# EAGLE schematic LAUNCHXL-TMS57004_RevB (EAGLE 6.1)

## Sheet 1 of 6: Block Diagram
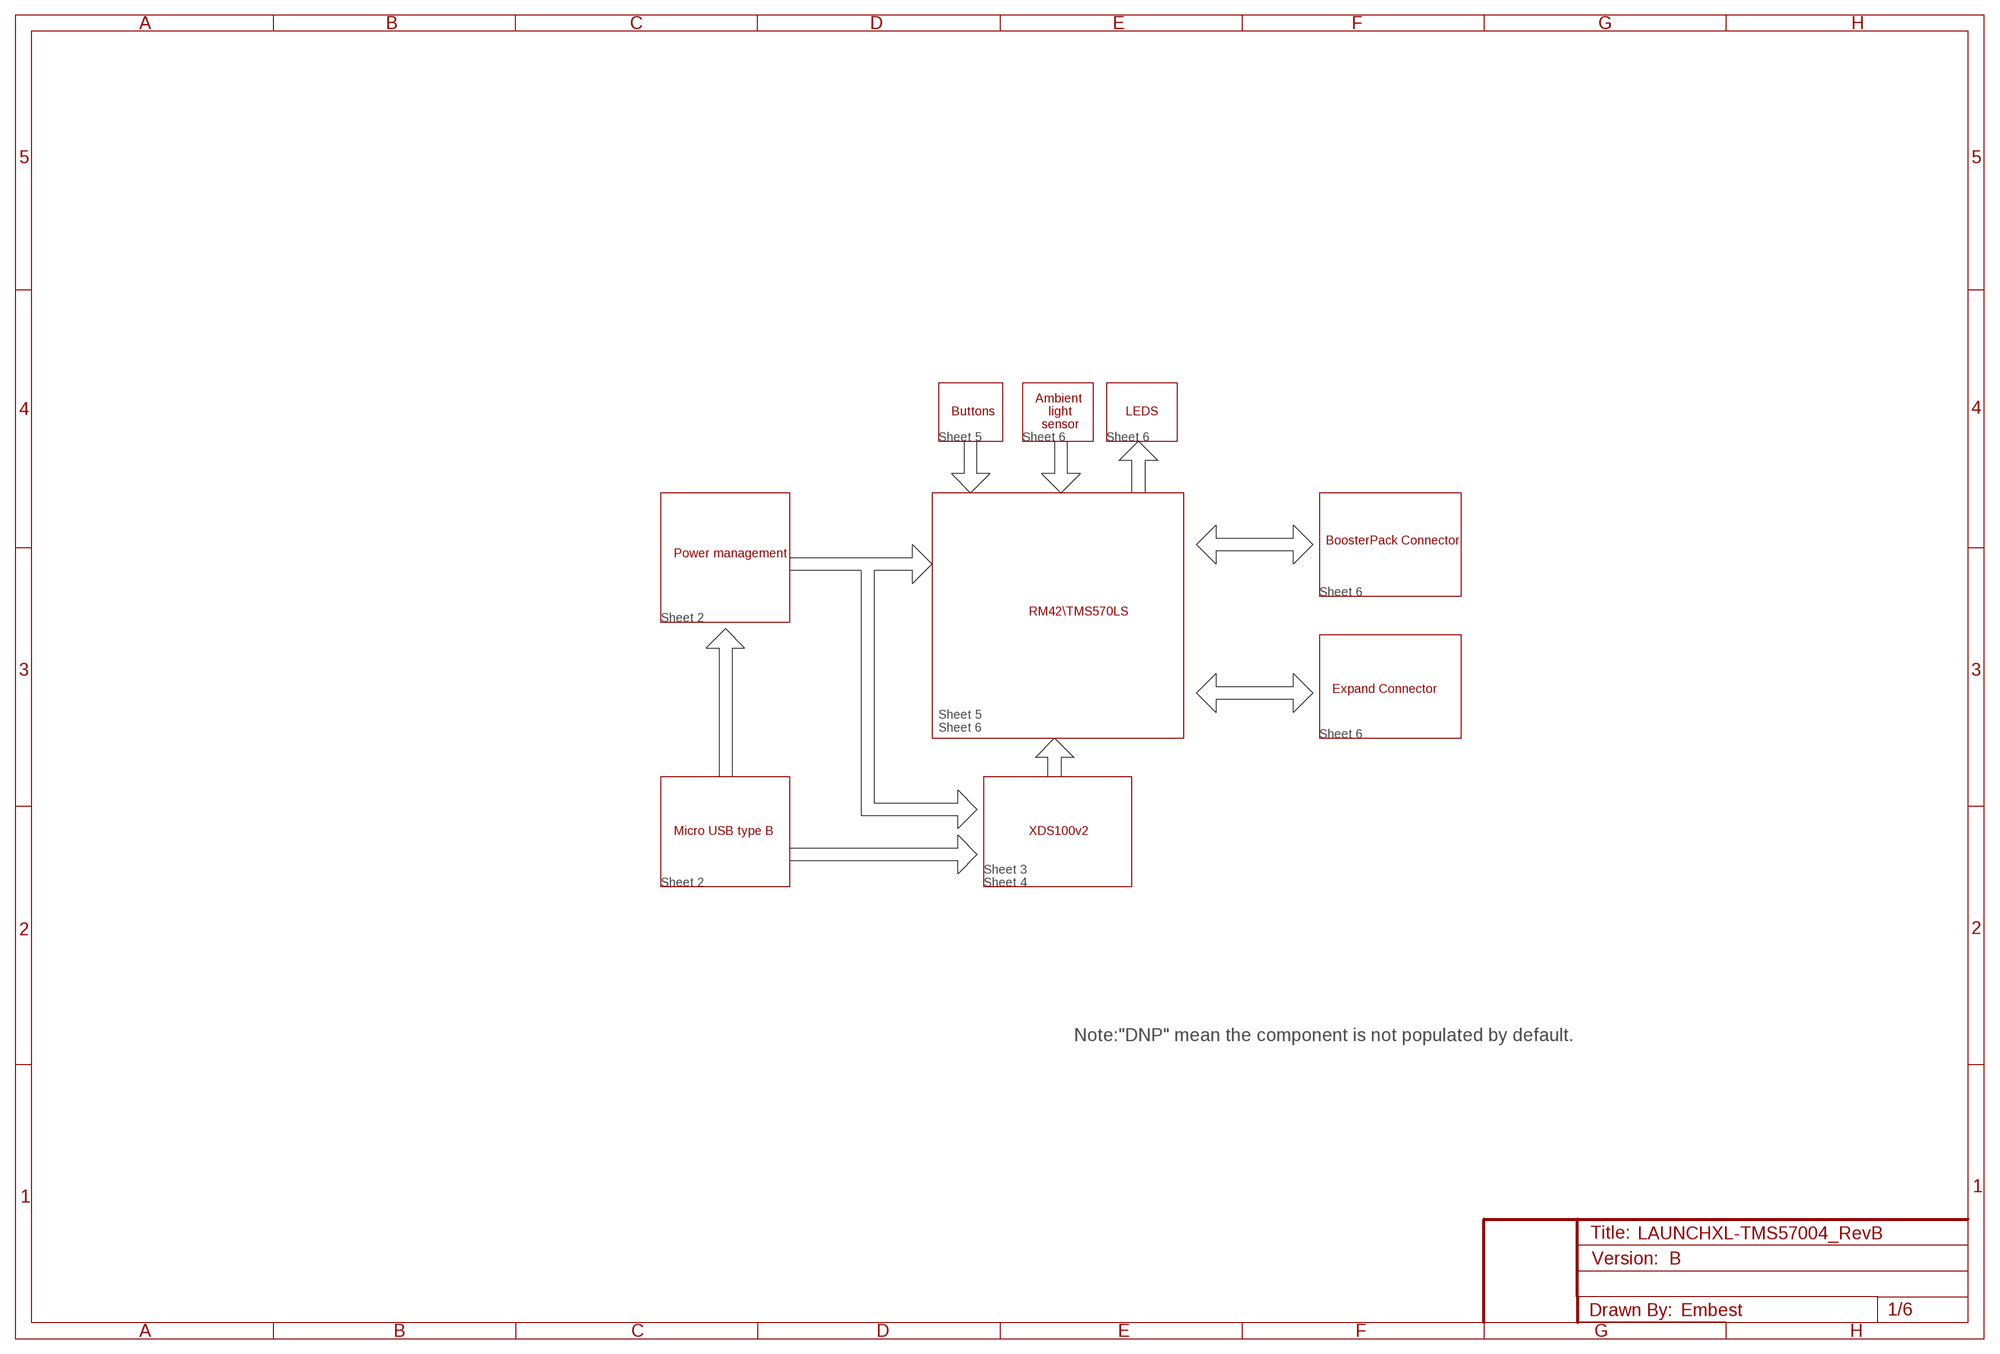
[diagram p0: schematic, sheet 1]

### Notes on the sheet
- Ambient
- Buttons | light | LEDS
- sensor
- Sheet 5 | Sheet 6 | Sheet 6
- BoosterPack Connector
- Power management
- Sheet 6
- RM42\\TMS570LS
- Sheet 2
- Expand Connector
- Sheet 5
- Sheet 6
- Sheet 6
- Micro USB type B | XDS100v2
- Sheet 3
- Sheet 2 | Sheet 4
- Note:"DNP" mean the component is not populated by default.
- B
- Embest

## Sheet 2 of 6: Power supply
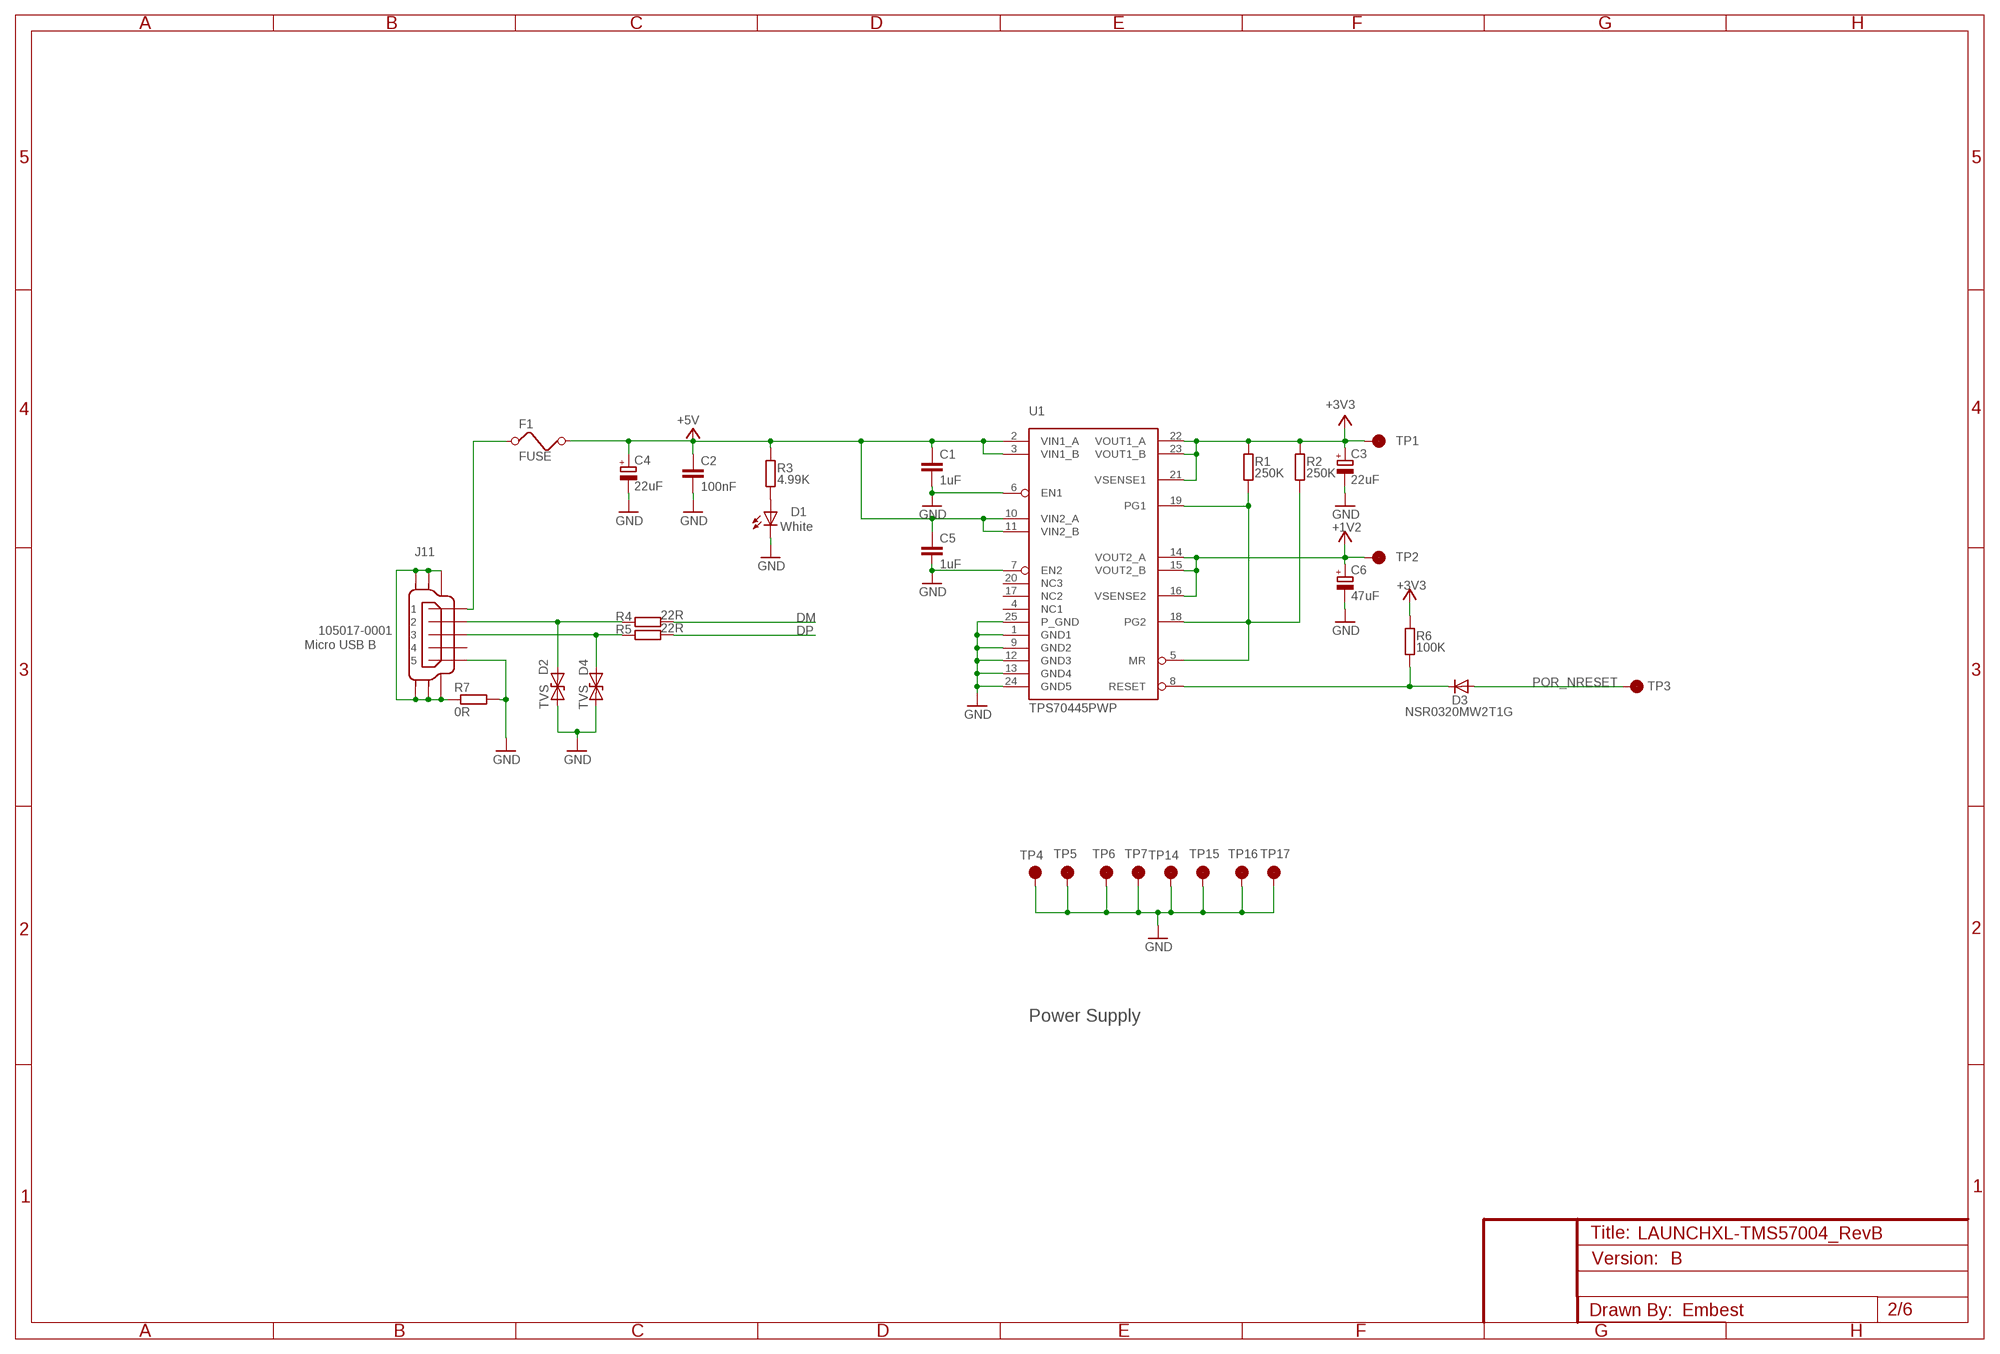
[diagram p1: schematic, sheet 2]

### Parts
C1  1uF  CAP0603  [0603]
C2  100nF  CAP0402  [0402]
C3  22uF  CAP-TAN  [CT3528]
C4  22uF  CAP-TAN  [CT3528]
C5  1uF  CAP0603  [0603]
C6  47uF  CAP-TAN  [CT3528]
D1  White  CHIP-LED  [LED0805]
D2  TVS  [0402]
D3  NSR0320MW2T1G  [SOD-323]
D4  TVS  [0402]
F1  FUSE  [0805]
J11  105017-0001  [MICRO_USB]
R1  250K  RES0402  [0402]
R2  250K  RES0402  [0402]
R3  4.99K  RES0402  [0402]
R4  22R  RES0402  [0402]
R5  22R  RES0402  [0402]
R6  100K  RES0402  [0402]
R7  0R  RES0603  [0603]
TP1  TP  [TP]
TP2  TP  [TP]
TP3  TP  [TP]
TP4  TP  [TP]
TP5  TP  [TP]
TP6  TP  [TP]
TP7  TP  [TP]
TP14  TP  [TP]
TP15  TP  [TP]
TP16  TP  [TP]
TP17  TP  [TP]
U1  TPS70445PWP  [TSSOP24]

### Nets
1A: F1.1 J11.1
+3V3: C3.+ R1.2 R2.2 R6.2 TP1.1 U1.21(VSENSE1) U1.22(VOUT1_A) U1.23(VOUT1_B) ; also sheet 3,4,5,6
+5V: C1.1 C2.1 C4.+ C5.1 F1.2 R3.2 U1.2(VIN1_A) U1.3(VIN1_B) U1.10(VIN2_A) U1.11(VIN2_B) ; also sheet 6
DM: R4.1 ; also sheet 3
DP: R5.1 ; also sheet 3
GND: C1.2 C2.2 C3.- C4.- C5.2 C6.- D1.C D2.1 D4.2 J11.5 R7.2 TP4.1 TP5.1 TP6.1 TP7.1 TP14.1 TP15.1 TP16.1 TP17.1 U1.1(GND1) U1.6(EN1) U1.7(EN2) U1.9(GND2) U1.12(GND3) U1.13(GND4) U1.24(GND5) U1.25(P_GND) ; also sheet 3,4,5,6
N$1: J11.6 J11.7 J11.8 J11.9 J11.10 J11.11 R7.1
N$4: D2.2 J11.2 R4.2
N$5: D4.1 J11.3 R5.2
N$6: D3.C R6.1 U1.8(RESET)
N$7: R1.1 R2.1 U1.5(MR) U1.18(PG2) U1.19(PG1)
N$8: D1.A R3.1
POR_NRESET: D3.A TP3.1 ; also sheet 5,6
VCC: C6.+ TP2.1 U1.14(VOUT2_A) U1.15(VOUT2_B) U1.16(VSENSE2) ; supply symbol labelled +1V2 ; also sheet 5
Unconnected: J11.4 U1.4(NC1) U1.17(NC2) U1.20(NC3)

### Notes on the sheet
- Micro USB B
- Power Supply
- B
- Embest

## Sheet 3 of 6: XDS100V2 FT2232HL
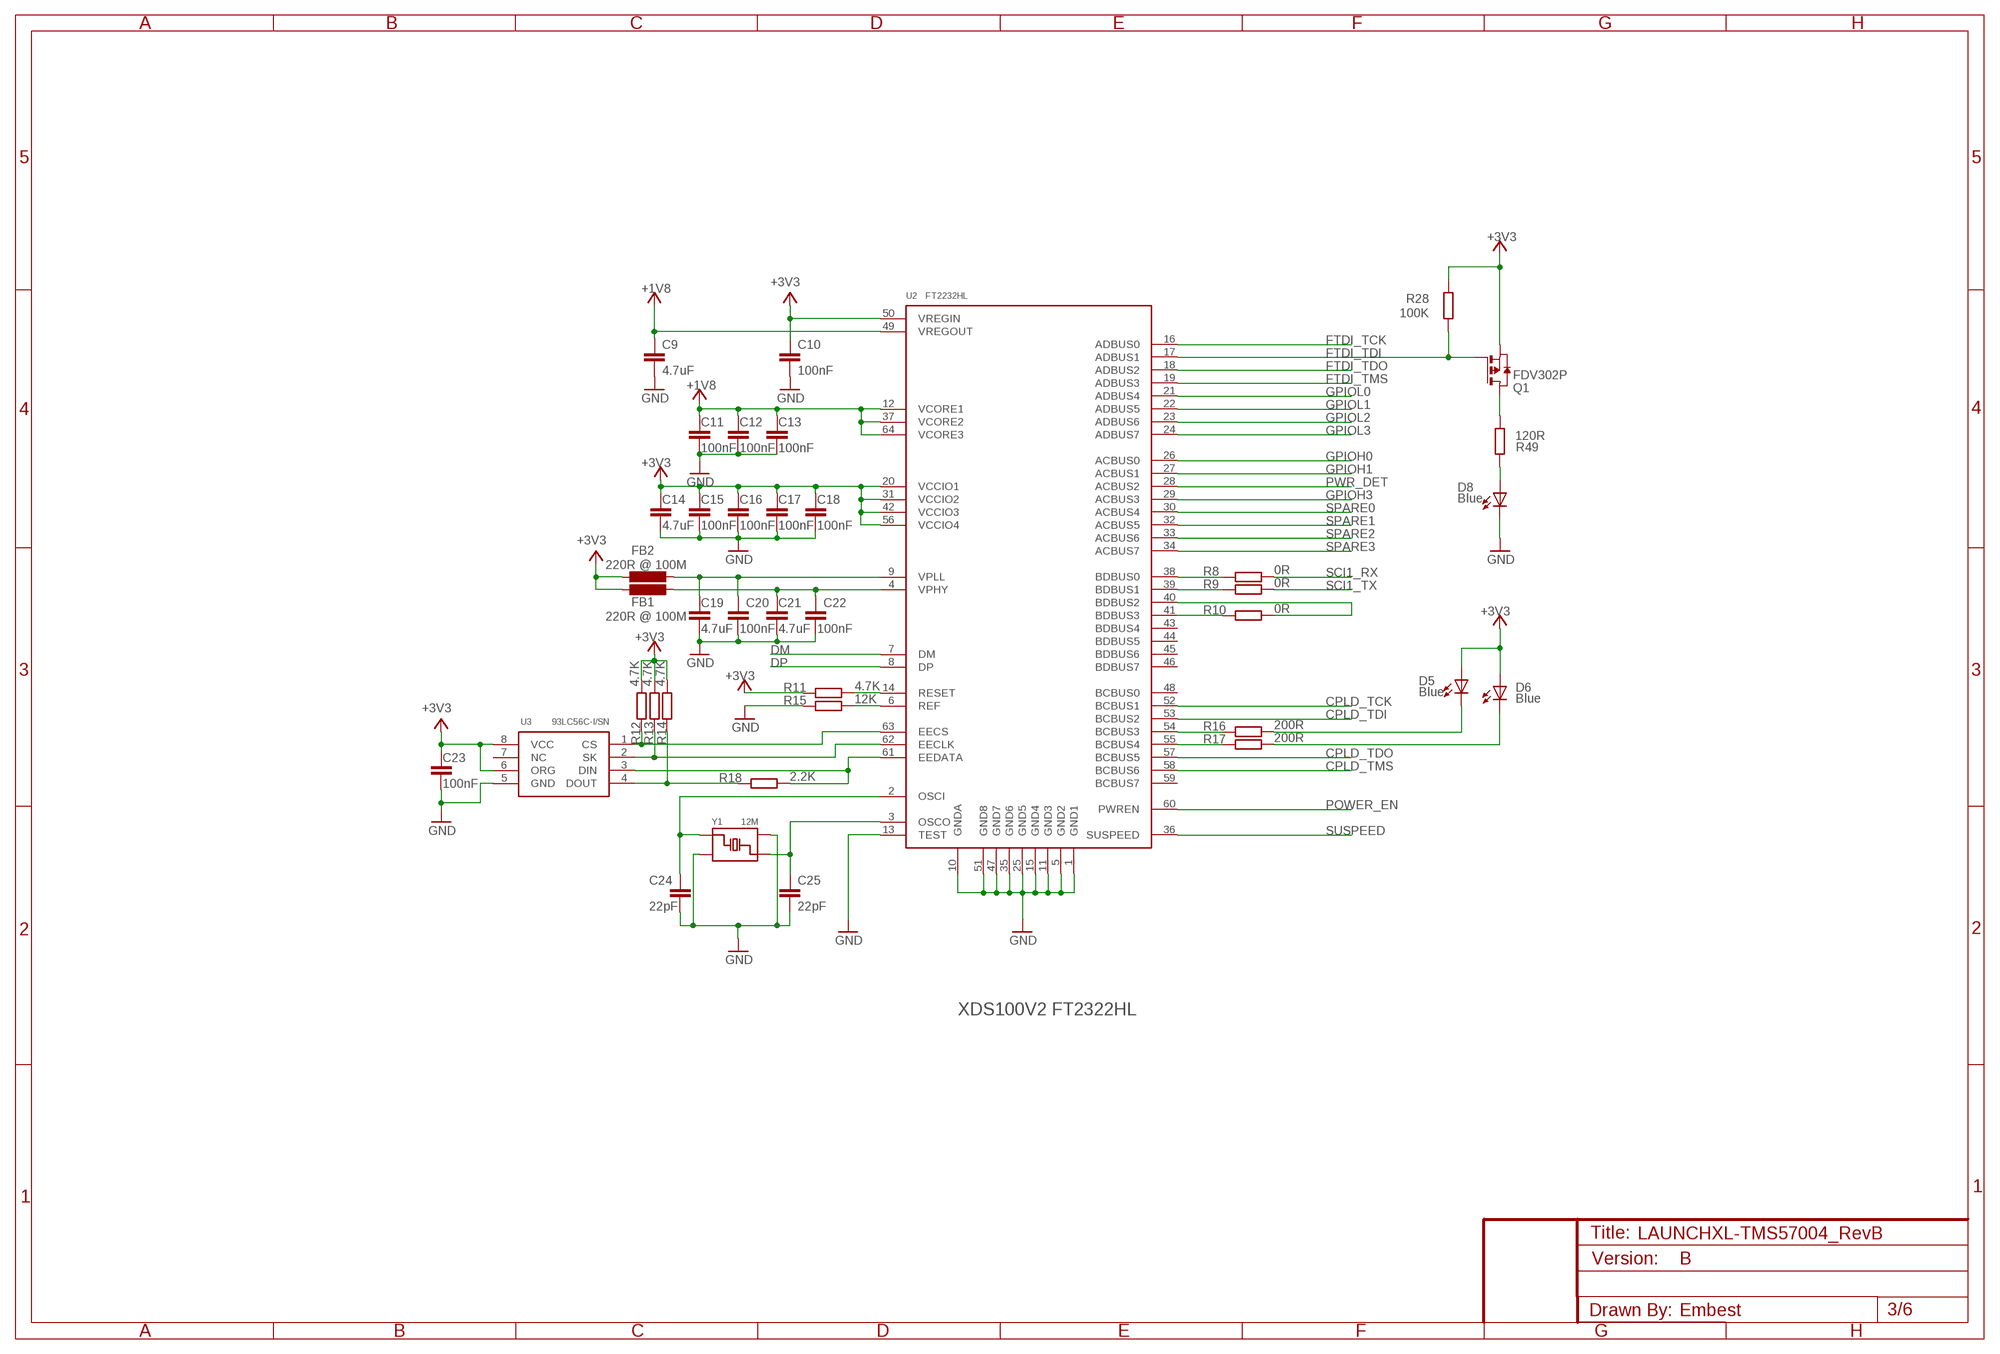
[diagram p2: schematic, sheet 3]

### Parts
C9  4.7uF  CAP0805  [0805]
C10  100nF  CAP0402  [0402]
C11  100nF  CAP0402  [0402]
C12  100nF  CAP0402  [0402]
C13  100nF  CAP0402  [0402]
C14  4.7uF  CAP0805  [0805]
C15  100nF  CAP0402  [0402]
C16  100nF  CAP0402  [0402]
C17  100nF  CAP0402  [0402]
C18  100nF  CAP0402  [0402]
C19  4.7uF  CAP0805  [0805]
C20  100nF  CAP0402  [0402]
C21  4.7uF  CAP0805  [0805]
C22  100nF  CAP0402  [0402]
C23  100nF  CAP0402  [0402]
C24  22pF  CAP0402  [0402]
C25  22pF  CAP0402  [0402]
D5  Blue  CHIP-LED  [LED0805]
D6  Blue  CHIP-LED  [LED0805]
D8  Blue  CHIP-LED  [LED0805]
FB1  220R @ 100M  INDUCTOR  [0805]
FB2  220R @ 100M  INDUCTOR  [0805]
Q1  FDV302P  PMOSSOT23  [SOT-23]
R8  0R  RES0402  [0402]
R9  0R  RES0402  [0402]
R10  0R  RES0402  [0402]
R11  4.7K  RES0402  [0402]
R12  4.7K  RES0402  [0402]
R13  4.7K  RES0402  [0402]
R14  4.7K  RES0402  [0402]
R15  12K  RES0402  [0402]
R16  200R  RES0402  [0402]
R17  200R  RES0402  [0402]
R18  2.2K  RES0402  [0402]
R28  100K  RES0402  [0402]
R49  120R  RES0402  [0402]
U2  FT2232HL  [LQFP64]
U3  93LC56C-I/SN  [SO8]
Y1  12M  CRYSTAL-SMD  [CRYSTAL_3225]

### Nets
+1V8: C9.1 C11.1 C12.1 C13.1 U2.12(VCORE1) U2.37(VCORE2) U2.49(VREGOUT) U2.64(VCORE3) ; also sheet 4
+3V3: C10.1 C14.1 C15.1 C16.1 C17.1 C18.1 C23.1 D5.A D6.A FB1.1 FB2.1 Q1.2(S) R11.1 R12.2 R13.2 R14.2 R28.2 U2.20(VCCIO1) U2.31(VCCIO2) U2.42(VCCIO3) U2.50(VREGIN) U2.56(VCCIO4) U3.6(ORG) U3.8(VCC) ; also sheet 2,4,5,6
CPLD_TCK: U2.52(BCBUS1) ; also sheet 4
CPLD_TDI: U2.53(BCBUS2) ; also sheet 4
CPLD_TDO: U2.57(BCBUS5) ; also sheet 4
CPLD_TMS: U2.58(BCBUS6) ; also sheet 4
DM: U2.7(DM) ; also sheet 2
DP: U2.8(DP) ; also sheet 2
FTDI_TCK: U2.16(ADBUS0) ; also sheet 4
FTDI_TDI: Q1.3(G) R28.1 U2.17(ADBUS1) ; also sheet 4
FTDI_TDO: U2.18(ADBUS2) ; also sheet 4
FTDI_TMS: U2.19(ADBUS3) ; also sheet 4
GND: C9.2 C10.2 C11.2 C12.2 C13.2 C14.2 C15.2 C16.2 C17.2 C18.2 C19.2 C20.2 C21.2 C22.2 C23.2 C24.2 C25.2 D8.C R15.1 U2.1(GND1) U2.5(GND2) U2.10(GNDA) U2.11(GND3) U2.13(TEST) U2.15(GND4) U2.25(GND5) U2.35(GND6) U2.47(GND7) U2.51(GND8) U3.5(GND) Y1.P$2 Y1.P$4 ; also sheet 2,4,5,6
GPIOH0: U2.26(ACBUS0) ; also sheet 4
GPIOH1: U2.27(ACBUS1) ; also sheet 4
GPIOH3: U2.29(ACBUS3) ; also sheet 4
GPIOL0: U2.21(ADBUS4) ; also sheet 4
GPIOL1: U2.22(ADBUS5) ; also sheet 4
GPIOL2: U2.23(ADBUS6) ; also sheet 4
GPIOL3: U2.24(ADBUS7) ; also sheet 4
N$2: C19.1 C20.1 FB1.2 U2.9(VPLL)
N$10: C21.1 C22.1 FB2.2 U2.4(VPHY)
N$11: R15.2 U2.6(REF)
N$12: R11.2 U2.14(RESET)
N$13: C24.1 U2.2(OSCI) Y1.P$3
N$14: C25.1 U2.3(OSCO) Y1.P$1
N$15: R12.1 U2.63(EECS) U3.1(CS)
N$16: R13.1 U2.62(EECLK) U3.2(SK)
N$17: R18.2 U2.61(EEDATA) U3.3(DIN)
N$18: R14.1 R18.1 U3.4(DOUT)
N$19: R8.1 U2.38(BDBUS0)
N$21: R9.1 U2.39(BDBUS1)
N$25: Q1.1(D) R49.2
N$37: D8.A R49.1
N$38: R10.2 U2.40(BDBUS2)
N$39: R10.1 U2.41(BDBUS3)
N$42: D5.C R16.2
N$43: D6.C R17.2
N$60: R16.1 U2.54(BCBUS3)
N$62: R17.1 U2.55(BCBUS4)
POWER_EN: U2.60(PWREN) ; also sheet 4
PWR_DET: U2.28(ACBUS2) ; also sheet 4
SCI1_RX: R8.2 ; also sheet 6
SCI1_TX: R9.2 ; also sheet 6
SPARE0: U2.30(ACBUS4) ; also sheet 4
SPARE1: U2.32(ACBUS5) ; also sheet 4
SPARE2: U2.33(ACBUS6) ; also sheet 4
SPARE3: U2.34(ACBUS7) ; also sheet 4
SUSPEED: U2.36(SUSPEED) ; also sheet 4
Unconnected: U2.43(BDBUS4) U2.44(BDBUS5) U2.45(BDBUS6) U2.46(BDBUS7) U2.48(BCBUS0) U2.59(BCBUS7) U3.7(NC)

### Notes on the sheet
- XDS100V2 FT2322HL
- B
- Embest

## Sheet 4 of 6: XDS100V2 CPLD
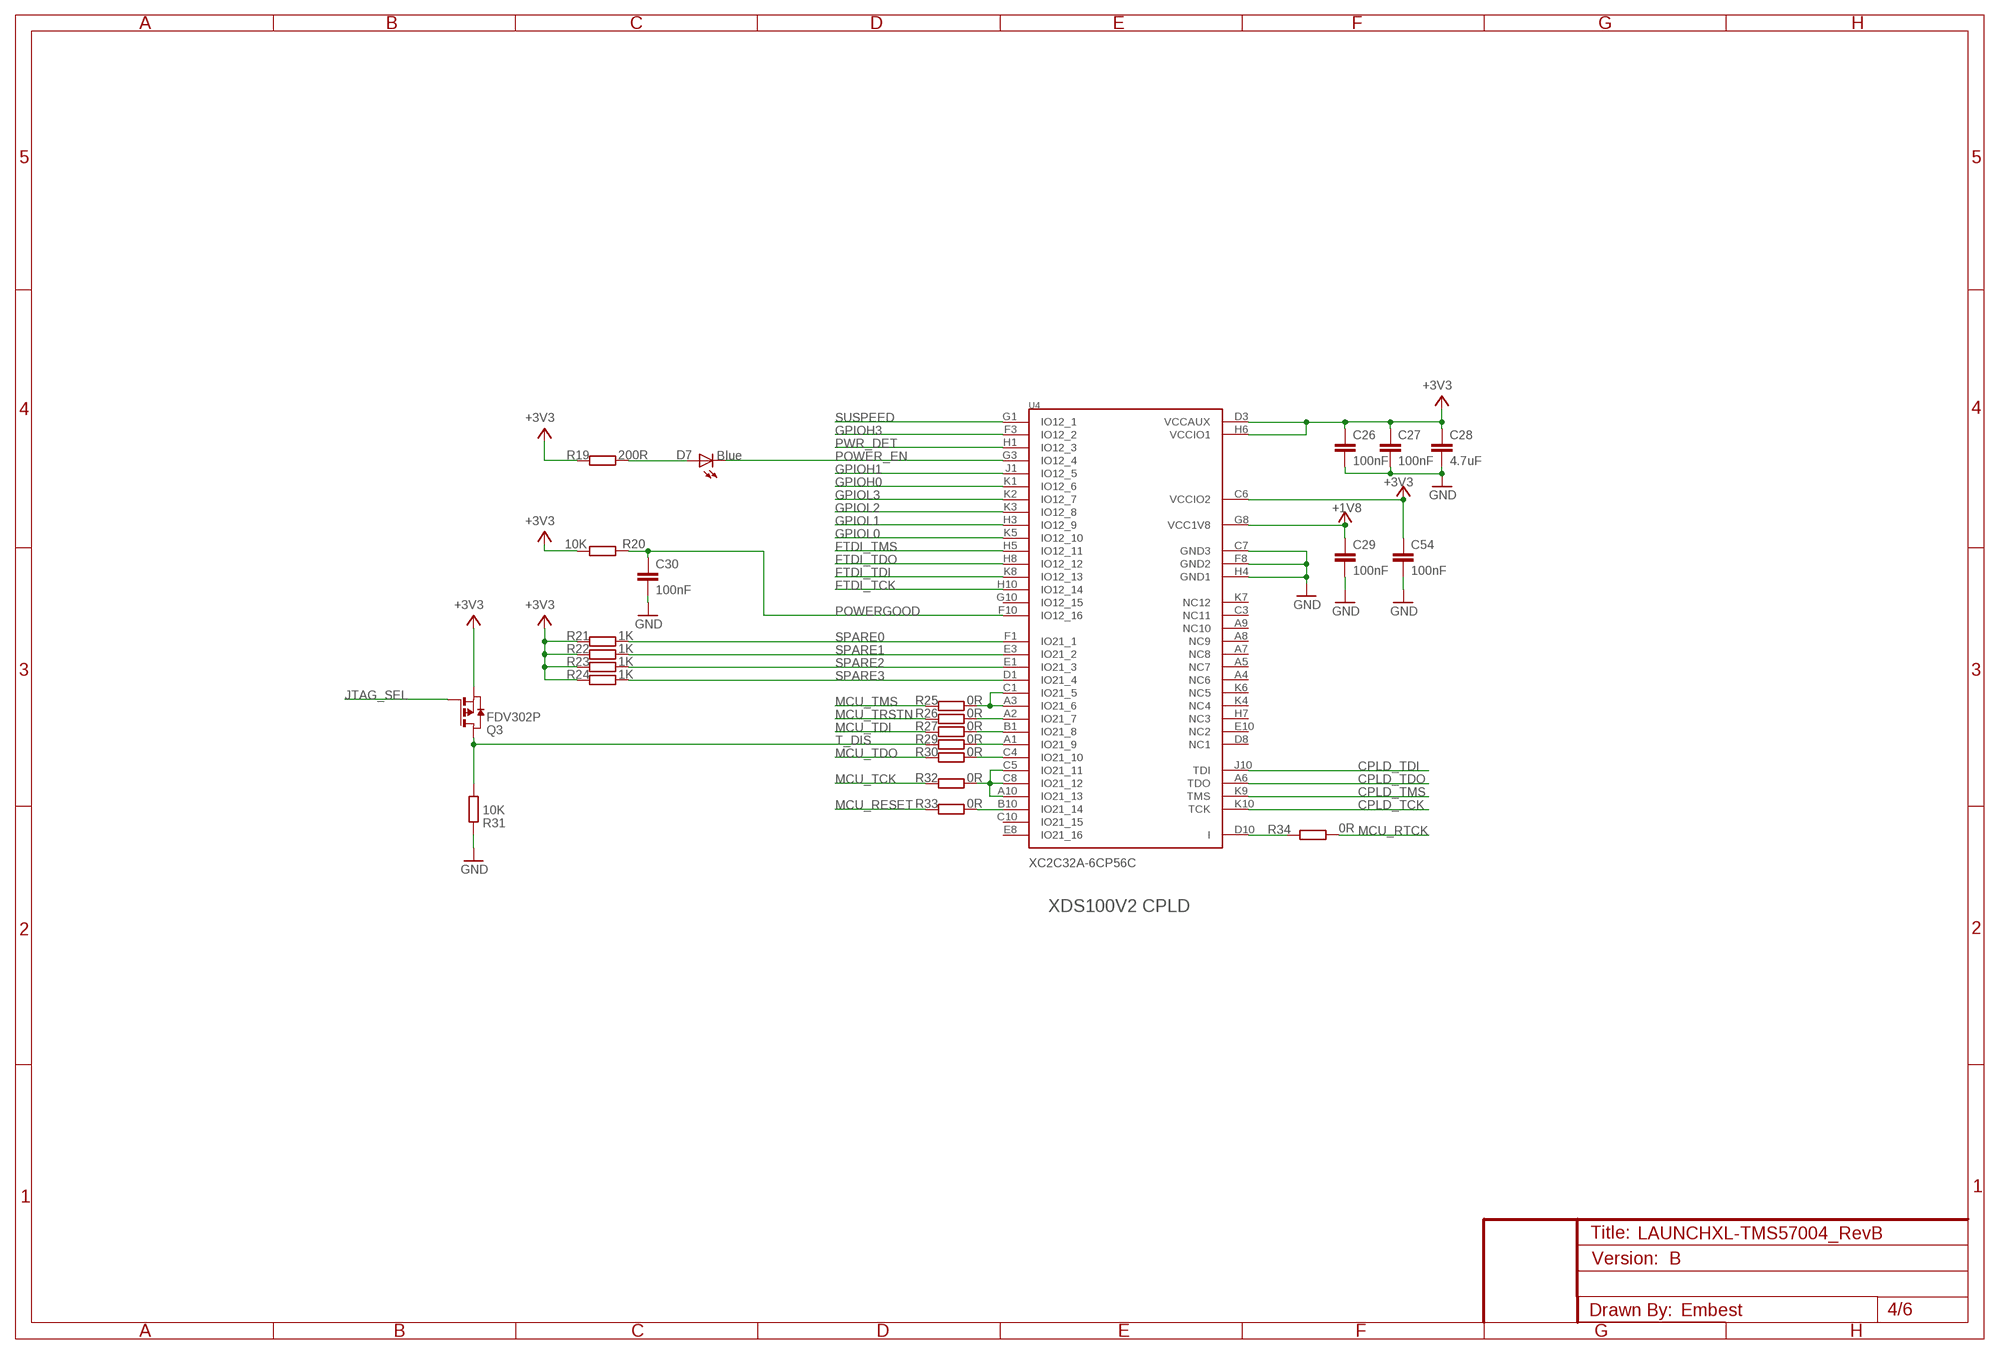
[diagram p3: schematic, sheet 4]

### Parts
C26  100nF  CAP0402  [0402]
C27  100nF  CAP0402  [0402]
C28  4.7uF  CAP0805  [0805]
C29  100nF  CAP0402  [0402]
C30  100nF  CAP0402  [0402]
C54  100nF  CAP0402  [0402]
D7  Blue  CHIP-LED  [LED0805]
Q3  FDV302P  PMOSSOT23  [SOT-23]
R19  200R  RES0402  [0402]
R20  10K  RES0402  [0402]
R21  1K  RES0402  [0402]
R22  1K  RES0402  [0402]
R23  1K  RES0402  [0402]
R24  1K  RES0402  [0402]
R25  0R  RES0402  [0402]
R26  0R  RES0402  [0402]
R27  0R  RES0402  [0402]
R29  0R  RES0402  [0402]
R30  0R  RES0402  [0402]
R31  10K  RES0402  [0402]
R32  0R  RES0402  [0402]
R33  0R  RES0402  [0402]
R34  0R  RES0402  [0402]
U4  XC2C32A-6CP56C  [CP56]

### Nets
+1V8: C29.1 U4.G8(VCC1V8) ; also sheet 3
+3V3: C26.1 C27.1 C28.1 C54.1 Q3.2(S) R19.1 R20.2 R21.1 R22.1 R23.1 R24.1 U4.C6(VCCIO2) U4.D3(VCCAUX) U4.H6(VCCIO1) ; also sheet 2,3,5,6
CPLD_TCK: U4.K10(TCK) ; also sheet 3
CPLD_TDI: U4.J10(TDI) ; also sheet 3
CPLD_TDO: U4.A6(TDO) ; also sheet 3
CPLD_TMS: U4.K9(TMS) ; also sheet 3
FTDI_TCK: U4.H10(IO12_14) ; also sheet 3
FTDI_TDI: U4.K8(IO12_13) ; also sheet 3
FTDI_TDO: U4.H8(IO12_12) ; also sheet 3
FTDI_TMS: U4.H5(IO12_11) ; also sheet 3
GND: C26.2 C27.2 C28.2 C29.2 C30.2 C54.2 R31.1 U4.C7(GND3) U4.F8(GND2) U4.H4(GND1) ; also sheet 2,3,5,6
GPIOH0: U4.K1(IO12_6) ; also sheet 3
GPIOH1: U4.J1(IO12_5) ; also sheet 3
GPIOH3: U4.F3(IO12_2) ; also sheet 3
GPIOL0: U4.K5(IO12_10) ; also sheet 3
GPIOL1: U4.H3(IO12_9) ; also sheet 3
GPIOL2: U4.K3(IO12_8) ; also sheet 3
GPIOL3: U4.K2(IO12_7) ; also sheet 3
JTAG_SEL: Q3.3(G) ; also sheet 5
MCU_RESET: R33.1 ; also sheet 5
MCU_RTCK: R34.2 ; also sheet 5
MCU_TCK: R32.1 ; also sheet 5
MCU_TDI: R27.1 ; also sheet 5
MCU_TDO: R30.1 ; also sheet 5
MCU_TMS: R25.1 ; also sheet 5
MCU_TRSTN: R26.1 ; also sheet 5
N$22: D7.A R19.2
N$29: R25.2 U4.A3(IO21_6) U4.C1(IO21_5)
N$31: R26.2 U4.A2(IO21_7)
N$32: R27.2 U4.B1(IO21_8)
N$33: R29.2 U4.A1(IO21_9)
N$34: R30.2 U4.C4(IO21_10)
N$35: R32.2 U4.A10(IO21_13) U4.C5(IO21_11) U4.C8(IO21_12)
N$36: R33.2 U4.B10(IO21_14)
N$40: R34.1 U4.D10(I)
POWER_EN: D7.C U4.G3(IO12_4) ; also sheet 3
POWERGOOD: C30.1 R20.1 U4.F10(IO12_16)
PWR_DET: U4.H1(IO12_3) ; also sheet 3
SPARE0: R21.2 U4.F1(IO21_1) ; also sheet 3
SPARE1: R22.2 U4.E3(IO21_2) ; also sheet 3
SPARE2: R23.2 U4.E1(IO21_3) ; also sheet 3
SPARE3: R24.2 U4.D1(IO21_4) ; also sheet 3
SUSPEED: U4.G1(IO12_1) ; also sheet 3
T_DIS: Q3.1(D) R29.1 R31.2
Unconnected: U4.A4(NC6) U4.A5(NC7) U4.A7(NC8) U4.A8(NC9) U4.A9(NC10) U4.C3(NC11) U4.C10(IO21_15) U4.D8(NC1) U4.E8(IO21_16) U4.E10(NC2) U4.G10(IO12_15) U4.H7(NC3) U4.K4(NC4) U4.K6(NC5) U4.K7(NC12)

### Notes on the sheet
- XDS100V2 CPLD
- B
- Embest

## Sheet 5 of 6: RM42\TMS570LS Power
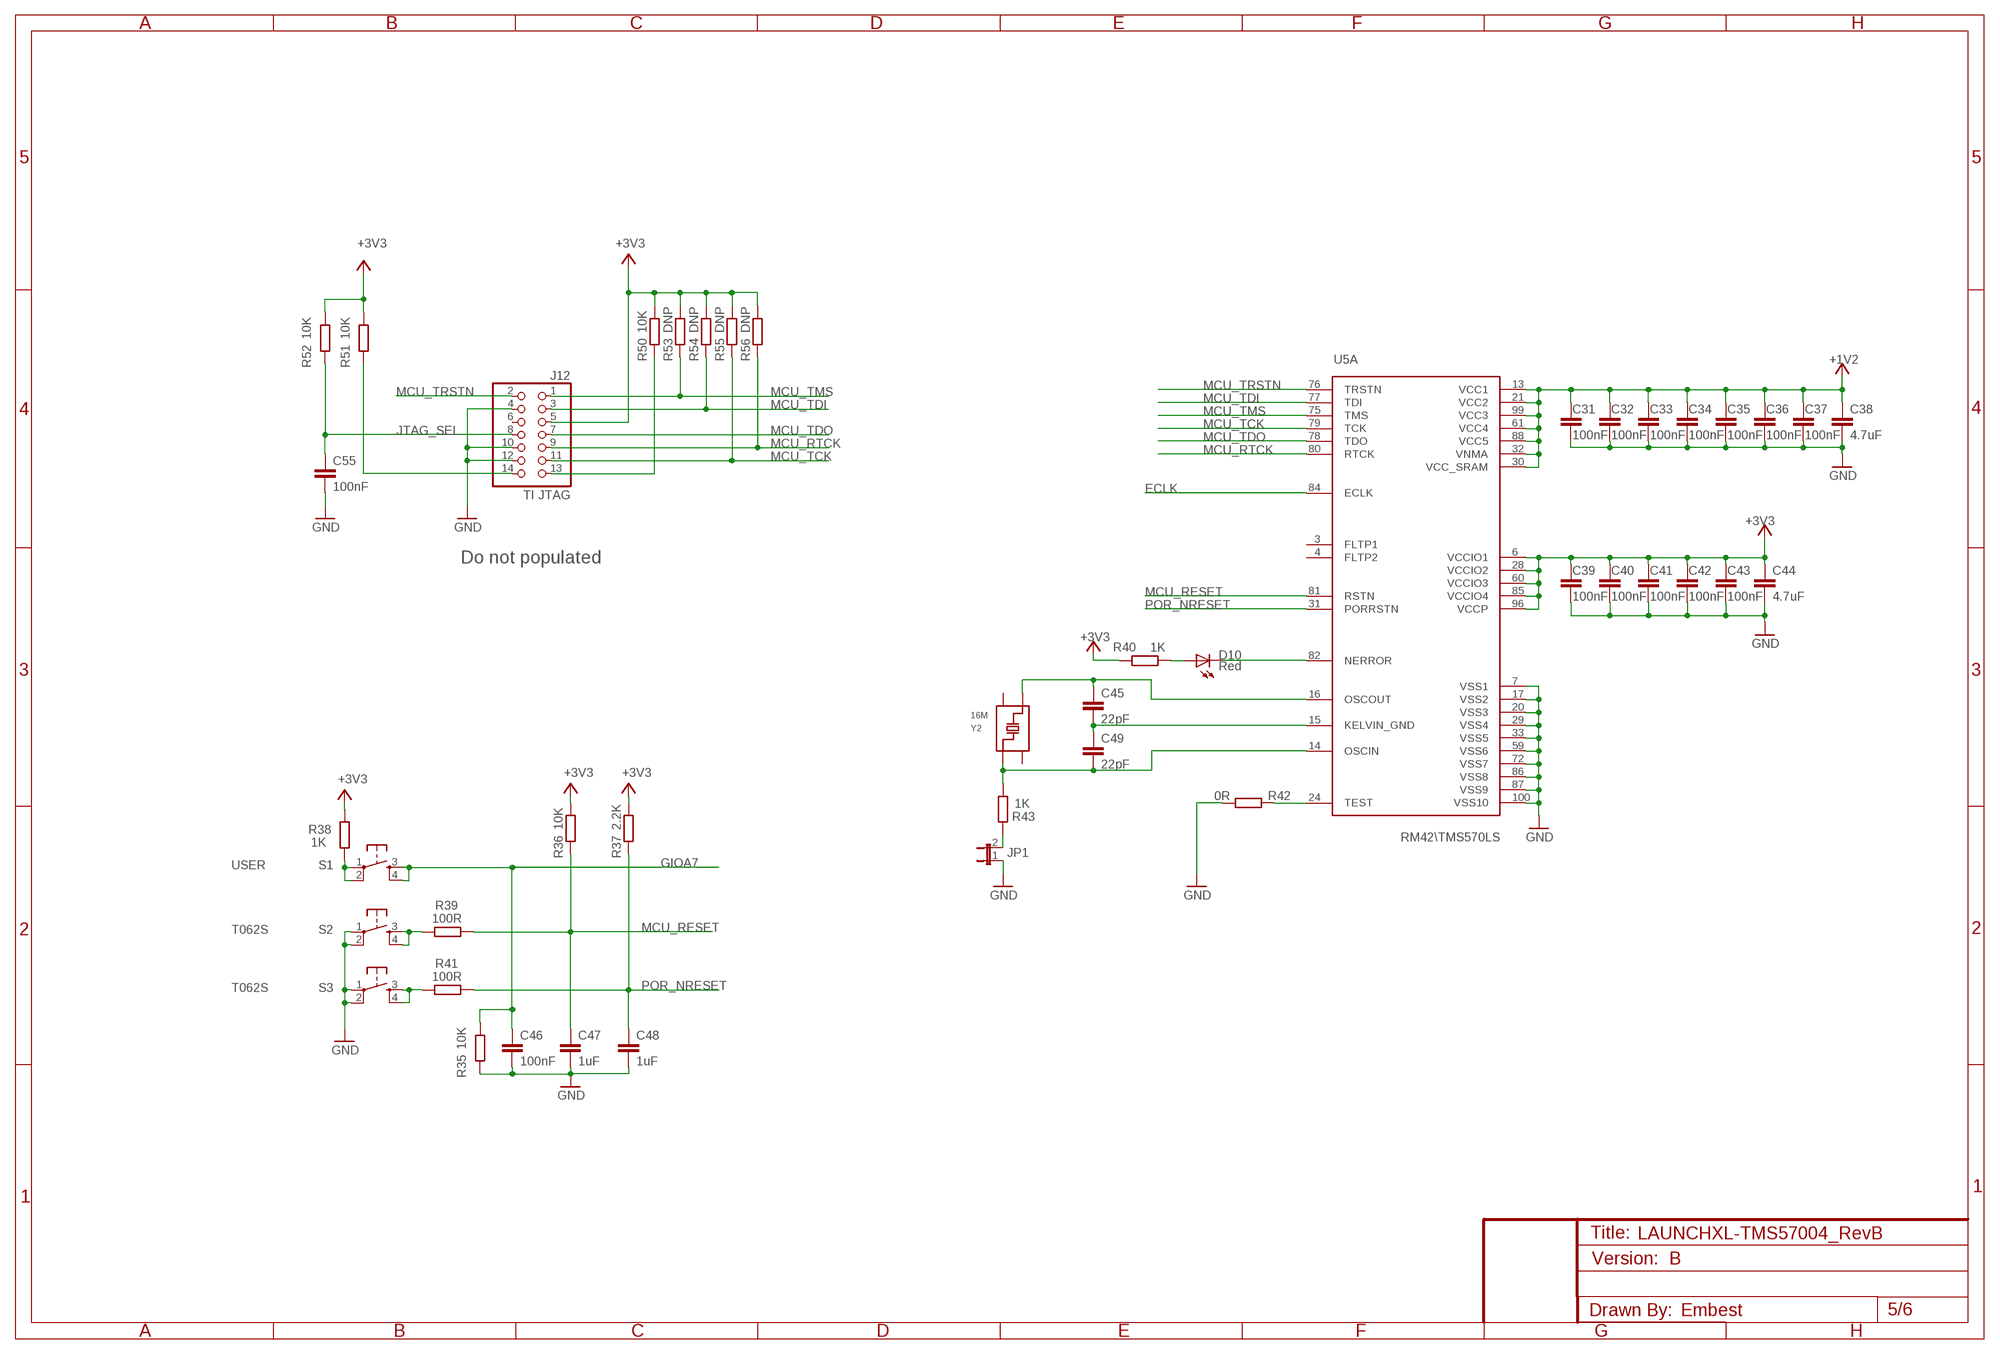
[diagram p4: schematic, sheet 5]

### Parts
C31  100nF  CAP0402  [0402]
C32  100nF  CAP0402  [0402]
C33  100nF  CAP0402  [0402]
C34  100nF  CAP0402  [0402]
C35  100nF  CAP0402  [0402]
C36  100nF  CAP0402  [0402]
C37  100nF  CAP0402  [0402]
C38  4.7uF  CAP0805  [0805]
C39  100nF  CAP0402  [0402]
C40  100nF  CAP0402  [0402]
C41  100nF  CAP0402  [0402]
C42  100nF  CAP0402  [0402]
C43  100nF  CAP0402  [0402]
C44  4.7uF  CAP0805  [0805]
C45  22pF  CAP0402  [0402]
C46  100nF  CAP0402  [0402]
C47  1uF  CAP0603  [0603]
C48  1uF  CAP0603  [0603]
C49  22pF  CAP0402  [0402]
C55  100nF  CAP0402  [0402]
D10  Red  CHIP-LED  [LED0805]
J12  TI JTAG  PINHEADER2X7  [BOXCONNECT2X7]
JP1  JUMPER_2.51MM  [JUMPER-2.54]
R35  10K  RES0402  [0402]
R36  10K  RES0402  [0402]
R37  2.2K  RES0402  [0402]
R38  1K  RES0402  [0402]
R39  100R  RES0402  [0402]
R40  1K  RES0402  [0402]
R41  100R  RES0402  [0402]
R42  0R  RES0402  [0402]
R43  1K  RES0402  [0402]
R50  10K  RES0402  [0402]
R51  10K  RES0402  [0402]
R52  10K  RES0402  [0402]
R53  DNP  RES0402  [0402]
R54  DNP  RES0402  [0402]
R55  DNP  RES0402  [0402]
R56  DNP  RES0402  [0402]
S1  USER  T062S  [T062S]
S2  T062S  [T062S]
S3  T062S  [T062S]
U5  RM42\\TMS570LS  RM42L432  [LQFP100]
Y2  16M  CRYSTAL-SMD  [CRYSTAL_3225]

### Nets
+3V3: C39.1 C40.1 C41.1 C42.1 C43.1 C44.1 J12.5 R36.2 R37.2 R38.1 R40.2 R50.2 R51.2 R52.2 R53.2 R54.2 R55.2 R56.2 U5.6(A:VCCIO1) U5.28(A:VCCIO2) U5.60(A:VCCIO3) U5.85(A:VCCIO4) U5.96(A:VCCP) ; also sheet 2,3,4,6
ECLK: U5.84(A:ECLK) ; also sheet 6
GIOA7: C46.1 R35.2 S1.3 S1.4 ; also sheet 6
GND: C31.2 C32.2 C33.2 C34.2 C35.2 C36.2 C37.2 C38.2 C39.2 C40.2 C41.2 C42.2 C43.2 C44.2 C46.2 C47.2 C48.2 C55.2 J12.4 J12.10 J12.12 JP1.1 R35.1 R42.2 S2.1 S2.2 S3.1 S3.2 U5.7(A:VSS1) U5.17(A:VSS2) U5.20(A:VSS3) U5.29(A:VSS4) U5.33(A:VSS5) U5.59(A:VSS6) U5.72(A:VSS7) U5.86(A:VSS8) U5.87(A:VSS9) U5.100(A:VSS10) ; also sheet 2,3,4,6
JTAG_SEL: C55.1 J12.8 R52.1 ; also sheet 4
MCU_RESET: C47.1 R36.1 R39.1 U5.81(A:RSTN) ; also sheet 4
MCU_RTCK: J12.9 R56.1 U5.80(A:RTCK) ; also sheet 4
MCU_TCK: J12.11 R55.1 U5.79(A:TCK) ; also sheet 4
MCU_TDI: J12.3 R54.1 U5.77(A:TDI) ; also sheet 4
MCU_TDO: J12.7 U5.78(A:TDO) ; also sheet 4
MCU_TMS: J12.1 R53.1 U5.75(A:TMS) ; also sheet 4
MCU_TRSTN: J12.2 U5.76(A:TRSTN) ; also sheet 4
N$3: R38.2 S1.1 S1.2
N$9: JP1.2 R43.2
N$20: R42.1 U5.24(A:TEST)
N$23: J12.14 R51.1
N$24: D10.A R40.1
N$26: C49.2 R43.1 U5.14(A:OSCIN) Y2.P$3
N$28: C45.2 C49.1 U5.15(A:KELVIN_GND)
N$30: C45.1 U5.16(A:OSCOUT) Y2.P$1
N$46: R39.2 S2.3 S2.4
N$47: R41.2 S3.3 S3.4
N$66: J12.13 R50.1
POR_NRESET: C48.1 R37.1 R41.1 U5.31(A:PORRSTN) ; also sheet 2,6
POWER_EN1: D10.C U5.82(A:NERROR)
VCC: C31.1 C32.1 C33.1 C34.1 C35.1 C36.1 C37.1 C38.1 U5.13(A:VCC1) U5.21(A:VCC2) U5.30(A:VCC_SRAM) U5.32(A:VNMA) U5.61(A:VCC4) U5.88(A:VCC5) U5.99(A:VCC3) ; supply symbol labelled +1V2 ; also sheet 2
Unconnected: J12.6 U5.3(A:FLTP1) U5.4(A:FLTP2) Y2.P$2 Y2.P$4

### Notes on the sheet
- Do not populated
- B
- Embest

## Sheet 6 of 6: launchpad interface
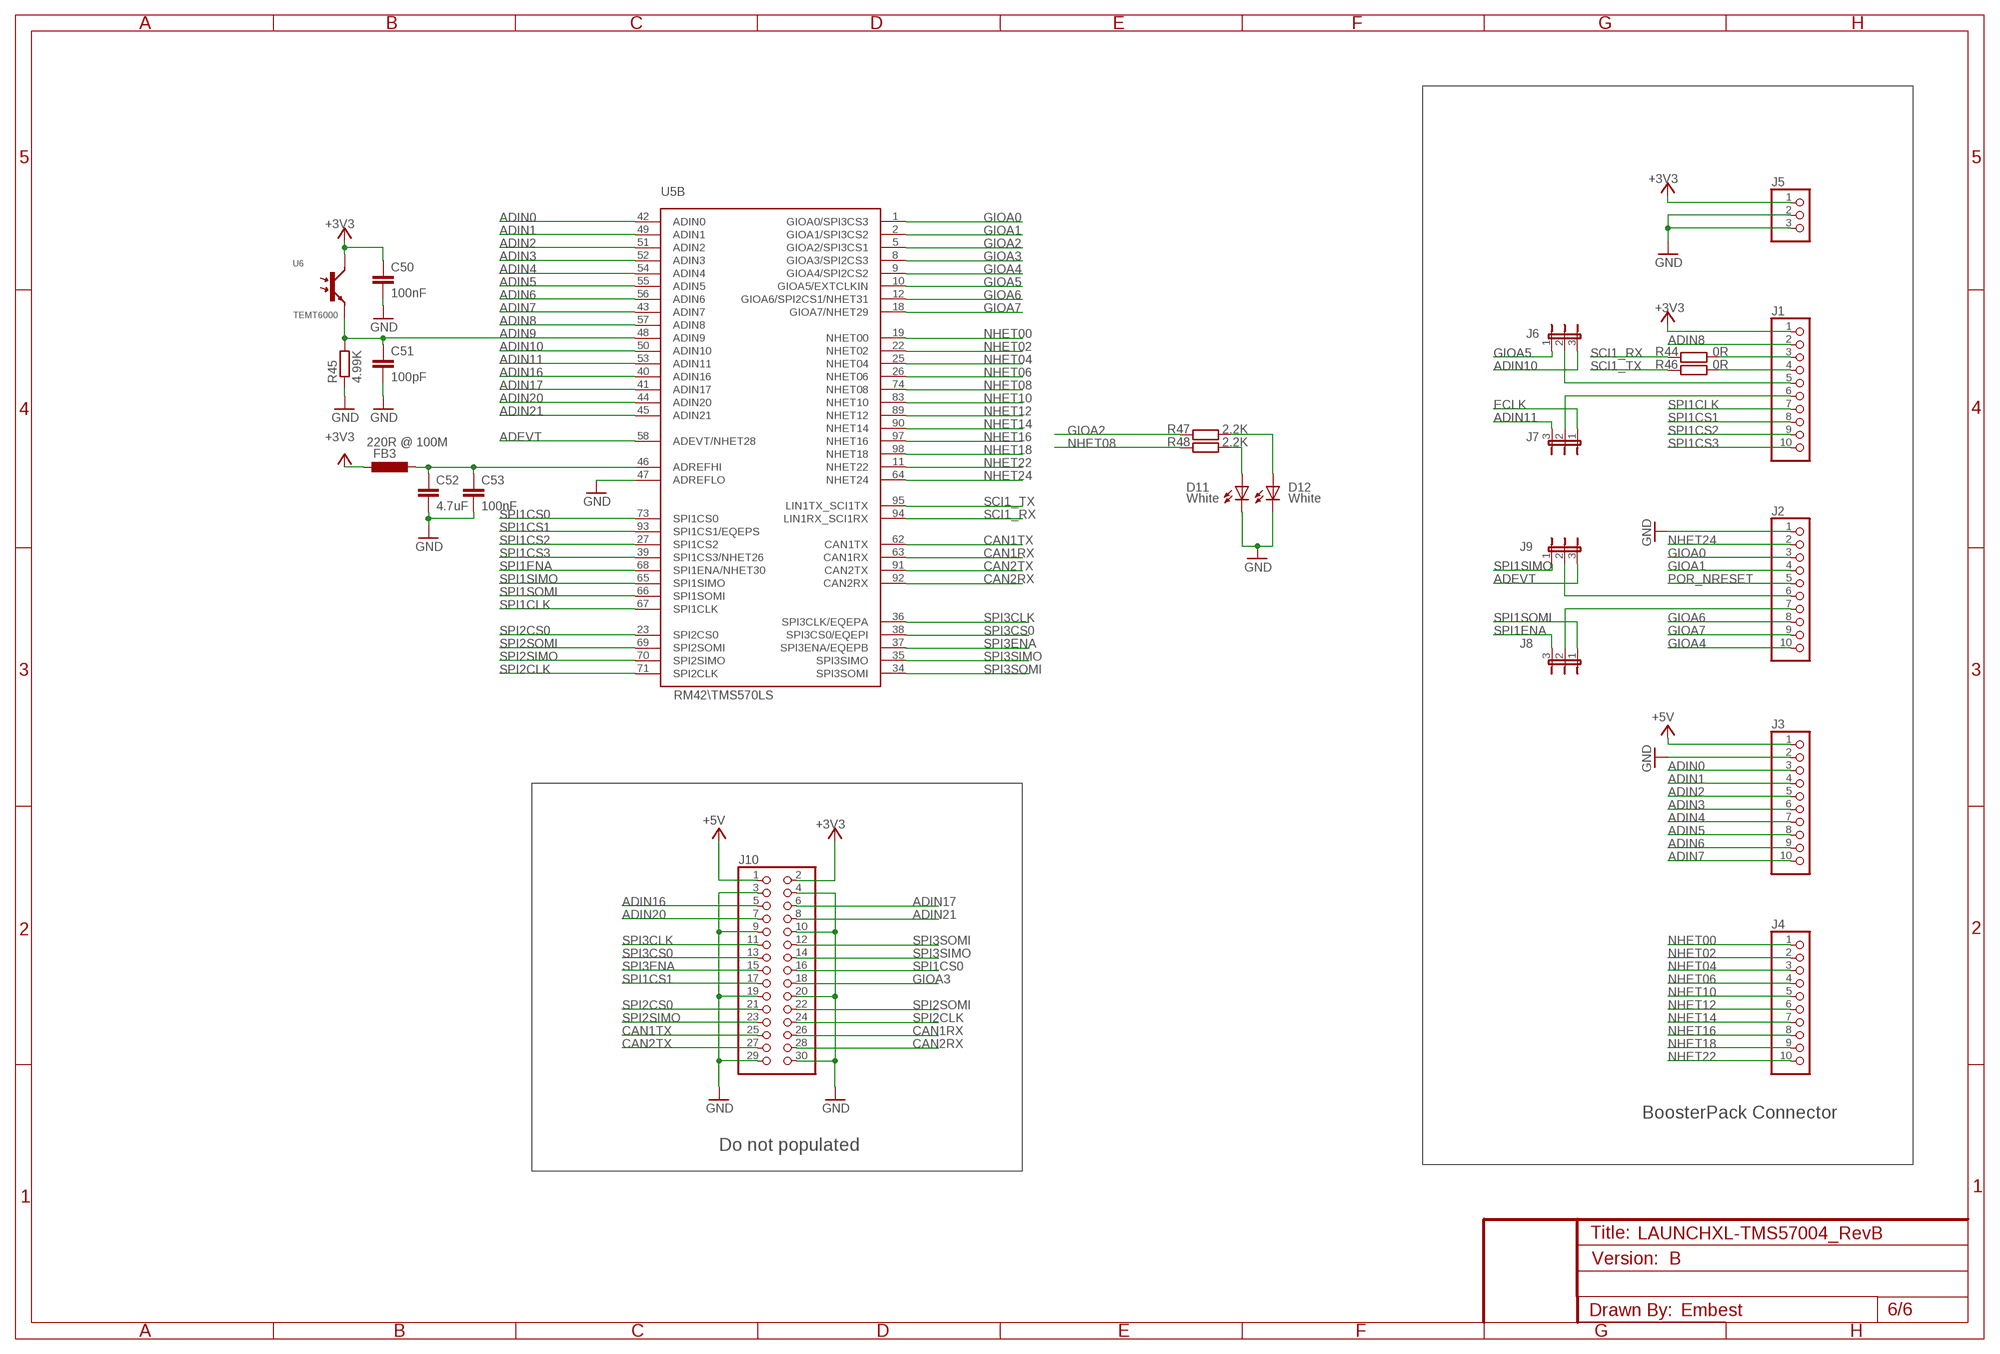
[diagram p5: schematic, sheet 6]

### Parts
C50  100nF  CAP0402  [0402]
C51  100pF  CAP0402  [0402]
C52  4.7uF  CAP0805  [0805]
C53  100nF  CAP0402  [0402]
D11  White  CHIP-LED  [LED0805]
D12  White  CHIP-LED  [LED0805]
FB3  220R @ 100M  INDUCTOR  [0805]
J1  PINHEADER1X10  [PINHEAFER1X10]
J2  PINHEADER1X10  [PINHEAFER1X10]
J3  PINHEADER1X10  [PINHEAFER1X10]
J4  PINHEADER1X10  [PINHEAFER1X10]
J5  PINHEADER1X3  [PINHEADER1X3]
J6  HEADER3-100  [HEADER3-100]
J7  HEADER3-100  [HEADER3-100]
J8  HEADER3-100  [HEADER3-100]
J9  HEADER3-100  [HEADER3-100]
J10  PINHD-2X15  [2X15]
R44  0R  RES0402  [0402]
R45  4.99K  RES0402  [0402]
R46  0R  RES0402  [0402]
R47  2.2K  RES0402  [0402]
R48  2.2K  RES0402  [0402]
U6  TEMT6000  [TEMT6000]

### Nets
+3V3: C50.1 FB3.1 J1.1 J5.1 J10.2 U6.3(C) ; also sheet 2,3,4,5
+5V: J3.1 J10.1 ; also sheet 2
ADEVT: J9.3 U5.58(B:ADEVT/NHET28)
ADIN0: J3.3 U5.42(B:ADIN0)
ADIN1: J3.4 U5.49(B:ADIN1)
ADIN2: J3.5 U5.51(B:ADIN2)
ADIN3: J3.6 U5.52(B:ADIN3)
ADIN4: J3.7 U5.54(B:ADIN4)
ADIN5: J3.8 U5.55(B:ADIN5)
ADIN6: J3.9 U5.56(B:ADIN6)
ADIN7: J3.10 U5.43(B:ADIN7)
ADIN8: J1.2 U5.57(B:ADIN8)
ADIN9: C51.1 R45.2 U5.48(B:ADIN9) U6.1(E)
ADIN10: J6.3 U5.50(B:ADIN10)
ADIN11: J7.3 U5.53(B:ADIN11)
ADIN16: J10.5 U5.40(B:ADIN16)
ADIN17: J10.6 U5.41(B:ADIN17)
ADIN20: J10.7 U5.44(B:ADIN20)
ADIN21: J10.8 U5.45(B:ADIN21)
CAN1RX: J10.26 U5.63(B:CAN1RX)
CAN1TX: J10.25 U5.62(B:CAN1TX)
CAN2RX: J10.28 U5.92(B:CAN2RX)
CAN2TX: J10.27 U5.91(B:CAN2TX)
ECLK: J7.1 ; also sheet 5
GIOA0: J2.3 U5.1(B:GIOA0/SPI3CS3)
GIOA1: J2.4 U5.2(B:GIOA1/SPI3CS2)
GIOA2: R47.2 U5.5(B:GIOA2/SPI3CS1)
GIOA3: J10.18 U5.8(B:GIOA3/SPI2CS3)
GIOA4: J2.10 U5.9(B:GIOA4/SPI2CS2)
GIOA5: J6.1 U5.10(B:GIOA5/EXTCLKIN)
GIOA6: J2.8 U5.12(B:GIOA6/SPI2CS1/NHET31)
GIOA7: J2.9 U5.18(B:GIOA7/NHET29) ; also sheet 5
GND: C50.2 C51.2 C52.2 C53.2 D11.C D12.C J2.1 J3.2 J5.2 J5.3 J10.3 J10.4 J10.9 J10.10 J10.19 J10.20 J10.29 J10.30 R45.1 U5.47(B:ADREFLO) ; also sheet 2,3,4,5
N$27: C52.1 C53.1 FB3.2 U5.46(B:ADREFHI)
N$41: J1.5 J6.2
N$45: D11.A R48.1
N$48: J1.6 J7.2
N$49: D12.A R47.1
N$50: J1.3 R44.1
N$51: J1.4 R46.1
N$53: J2.6 J9.2
N$54: J2.7 J8.2
NHET00: J4.1 U5.19(B:NHET00)
NHET02: J4.2 U5.22(B:NHET02)
NHET04: J4.3 U5.25(B:NHET04)
NHET06: J4.4 U5.26(B:NHET06)
NHET08: R48.2 U5.74(B:NHET08)
NHET10: J4.5 U5.83(B:NHET10)
NHET12: J4.6 U5.89(B:NHET12)
NHET14: J4.7 U5.90(B:NHET14)
NHET16: J4.8 U5.97(B:NHET16)
NHET18: J4.9 U5.98(B:NHET18)
NHET22: J4.10 U5.11(B:NHET22)
NHET24: J2.2 U5.64(B:NHET24)
POR_NRESET: J2.5 ; also sheet 2,5
SCI1_RX: R44.2 U5.94(B:LIN1RX_SCI1RX) ; also sheet 3
SCI1_TX: R46.2 U5.95(B:LIN1TX_SCI1TX) ; also sheet 3
SPI1CLK: J1.7 U5.67(B:SPI1CLK)
SPI1CS0: J10.16 U5.73(B:SPI1CS0)
SPI1CS1: J1.8 J10.17 U5.93(B:SPI1CS1/EQEPS)
SPI1CS2: J1.9 U5.27(B:SPI1CS2)
SPI1CS3: J1.10 U5.39(B:SPI1CS3/NHET26)
SPI1ENA: J8.3 U5.68(B:SPI1ENA/NHET30)
SPI1SIMO: J9.1 U5.65(B:SPI1SIMO)
SPI1SOMI: J8.1 U5.66(B:SPI1SOMI)
SPI2CLK: J10.24 U5.71(B:SPI2CLK)
SPI2CS0: J10.21 U5.23(B:SPI2CS0)
SPI2SIMO: J10.23 U5.70(B:SPI2SIMO)
SPI2SOMI: J10.22 U5.69(B:SPI2SOMI)
SPI3CLK: J10.11 U5.36(B:SPI3CLK/EQEPA)
SPI3CS0: J10.13 U5.38(B:SPI3CS0/EQEPI)
SPI3ENA: J10.15 U5.37(B:SPI3ENA/EQEPB)
SPI3SIMO: J10.14 U5.35(B:SPI3SIMO)
SPI3SOMI: J10.12 U5.34(B:SPI3SOMI)
Unconnected: U6.2(NC)

### Notes on the sheet
- BoosterPack Connector
- Do not populated
- B
- Embest

## Library data of the parts
C1 C2 C5 C9-C55 = launchpad:CAP
C3 C4 C6 = launchpad:CAP-TAN
D1 D5-D8 D10-D12 = launchpad:CHIP-LED
D2 D4 = launchpad:TVS
D3 = launchpad:NSR0320MW2T1G
F1 = launchpad:FUSE
FB1-FB3 = launchpad:INDUCTOR
J1-J4 = launchpad:PINHEADER1X10
J5 = launchpad:PINHEADER1X3
J6-J9 = launchpad:HEADER3-100
J10 = pinhead:PINHD-2X15: PIN HEADER
J11 = launchpad:105017-0001: 105017-0001 molex
J12 = launchpad:PINHEADER2X7
JP1 = launchpad:JUMPER_2.51MM
Q1 Q3 = zetex:PMOSSOT23: MOS FET; OC_FARNELL: unknown; OC_NEWARK: unknown
R1-R56 = launchpad:RES
S1-S3 = launchpad:T062S
TP1-TP7 TP14-TP17 = launchpad:TP
U1 = launchpad:TPS70445PWP: TPS70445PWP
U2 = launchpad:FT2232HL: FT2232HL
U3 = launchpad:93LC56C-I/SN
U4 = launchpad:XC2C32A-6CP56C: XC2C32A-6CP56C
U5 = launchpad:RM42L432
U6 = launchpad:TEMT6000
Y1 Y2 = launchpad:CRYSTAL-SMD